# Altium schematic sheet PWR_SW.SchDoc
size A4; SheetNumber: 11; SheetTotal: 21
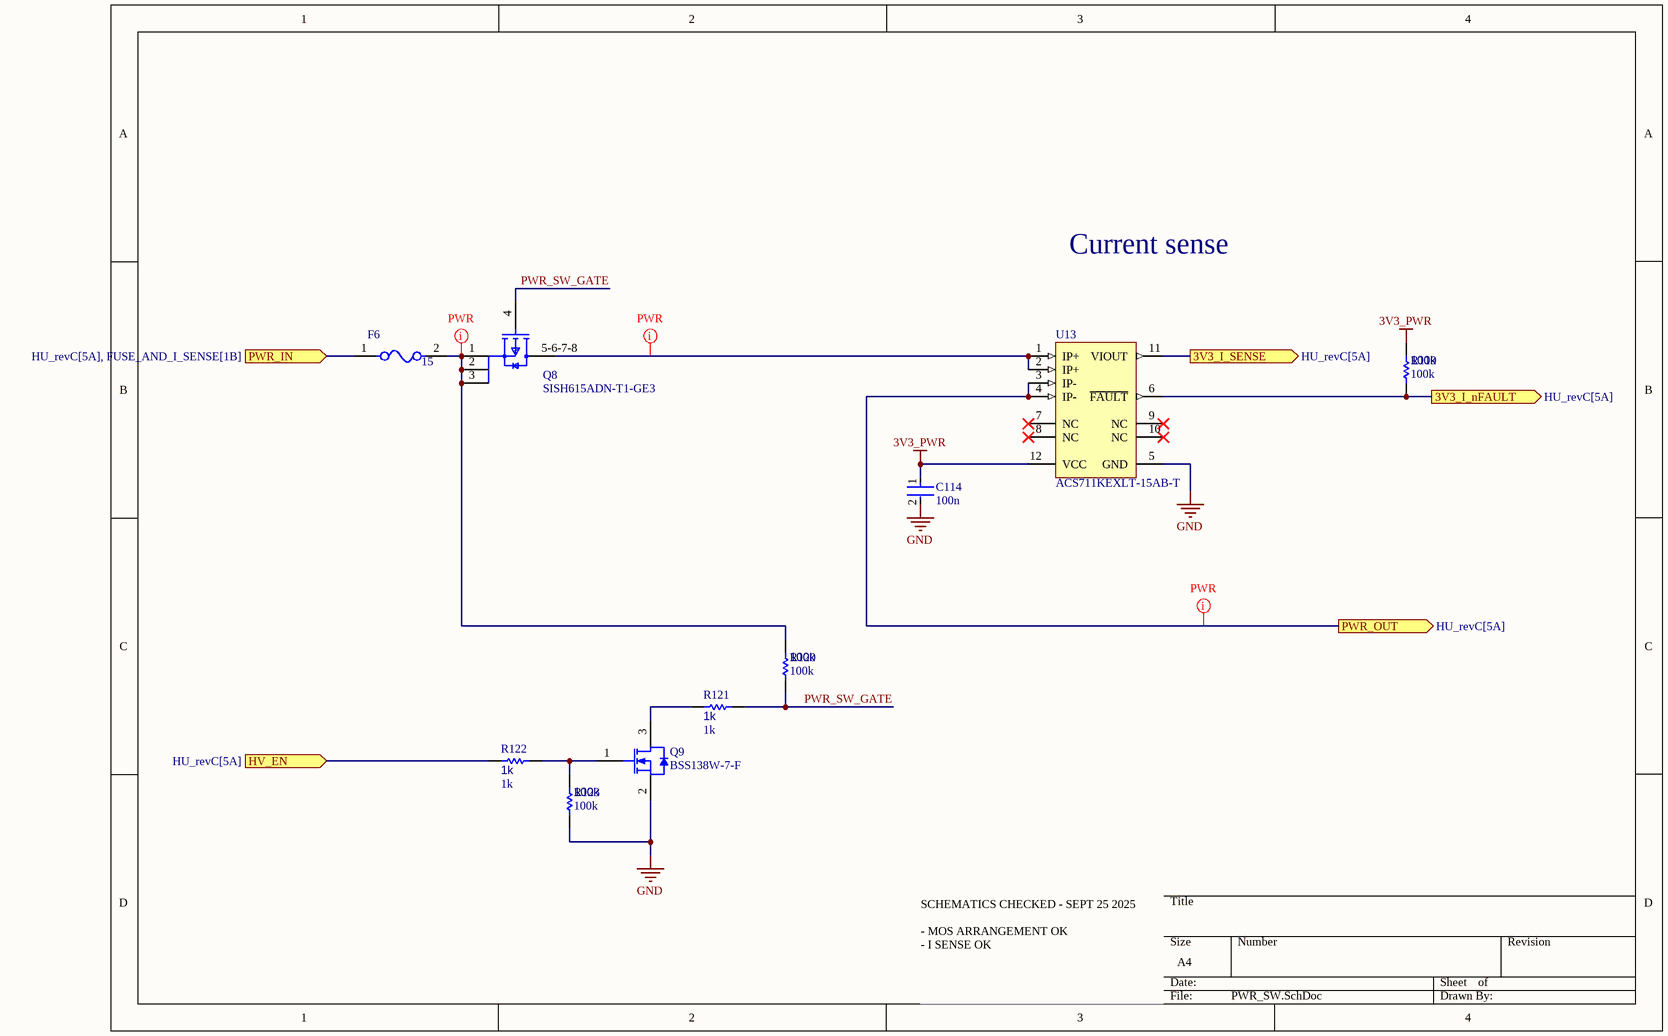
[diagram p0: PWR_SW.SchDoc]

## Parts
C114  100n  [FP-0402-L_1_0_0_05-W_0_5-IPC_A]
F6  15  [FP-0685T-MFG]
Q8  SISH615ADN-T1-GE3  [SISH615ADN-T1-GE3-Footprint-1]
Q9  BSS138W-7-F  [DIOD-SOT323-3_V]
R119  100k  [R0603B]
R120  100k  [R0603B]
R121  1k  [R0603B]
R122  1k  [R0603B]
R123  100k  [R0603B]
U13  ACS711KEXLT-15AB-T  [ALEG-EX-12_V]

## Ports
3V3_I_nFAULT (out, see HU_revC[5A]), 3V3_I_SENSE (out, see HU_revC[5A]), HV_EN (in, see HU_revC[5A]), PWR_IN (in, see HU_revC[5A], FUSE_AND_I_SENSE[1B]), PWR_OUT (out, see HU_revC[5A])

## Nets
3V3_PWR: C114.1 R119.2 U13.12(VCC)
GND: C114.2 Q9.2(S) R123.1 U13.5(GND)
3V3_I_nFAULT: R119.1 U13.6(~{FAULT}) ; port 3V3_I_nFAULT
3V3_I_SENSE: U13.11(VIOUT) ; port 3V3_I_SENSE
HV_EN: R122.1 ; port HV_EN
PWR_IN: F6.1 ; port PWR_IN
PWR_OUT: U13.3(IP-) U13.4(IP-) ; port PWR_OUT
PWR_SW_GATE: Q8.4(G) R120.1 R121.2
NetF6_2: F6.2 Q8.1(S) Q8.2(S) Q8.3(S) R120.2
NetQ8_5-6-7-8: Q8.5-6-7-8(D) U13.1(IP+) U13.2(IP+)
NetQ9_1: Q9.1(G) R122.2 R123.2
NetQ9_3: Q9.3(D) R121.1

Not connected (* = marked no-connect by the designer): U13 7(NC)* 8(NC)* 9(NC)* 10(NC)*

## Layout directives
net class PWR: NetF6_2, NetQ8_5-6-7-8, PWR_OUT

## Notes on the sheet
- Current sense
- SCHEMATICS CHECKED - SEPT 25 2025
  - MOS ARRANGEMENT OK
  - I SENSE OK

## Library data of the parts
C114 = CMP-001-00058-1: LARGE PADS, 0402 CAP, CHANGE COMMENT TO MATCH REAL P/N; Capacitor Type: Ceramic; Min Operating Temperature: -55°C; Mounting Technology: Surface Mount; Pins: 2; Case/Package: 0402; RoHS Compliant: Yes; Max Operating Temperature: 85°C
F6 = CMP-16042-000006-1: FUSE BOARD MNT 5A 63VAC/VDC 1206; RoHS Compliant: Yes
Q8 = CMP-013-00018-2: Trans MOSFET P-CH 20V 22.1A 8-Pin PowerPAK 1212 EP T/R; Source: SISH615ADN-T1-GE3.SchLib; Design Item ID: CMP-013-00036-4; Component Type: Standard; Pins: 5
Q9 = CMP-2000-05968-1: N-Channel Enhancement Mode Mosfet, 50 V, 200 mA, -55 to 150 degC, 6-Pin SOT-323, RoHS, Tape and Reel; Typical Turn-Off Delay Time: 20ns; Number of Channels: 1Channel; Type: EnhancementModeFieldEffectTransistor; Brand: DiodesIncorporated; Vds - Drain-Source Breakdown Voltage: 75V; Vgs - Gate-Source Voltage: 20V; Rds On - Drain-Source Resistance: 1.4Ohms; Transistor Type: 1N-Channel; Configuration: Single; Unit Weight: 0.000212oz; Pd - Power Dissipation: 200mW; Id - Continuous Drain Current: 200mA; Forward Transconductance - Min: 0.1S; Manufacturer URL: http://www.diodes.com/; Series: BSS138; Package Description: 3-Pin Small Outline Transistor, Body 2 x 1.25 mm, Pitch 0.65 mm; Mounting Technology: SurfaceMount; Product Category: MOSFET; RoHS: True; Maximum Operating Temperature: +150C; Height: 1mm; Length: 2.2mm; Technology: Si; Width: 1.35mm; Datasheet URL: http://www.diodes.com/_files/datasheets/ds30206.pdf; Manufacturer: DiodesIncorporated; Package / Case: SOT-323-3; Typical Turn-On Delay Time: 20ns; Transistor Polarity: N-Channel; Factory Pack Quantity: 3000; Packaging: Reel; Product: MOSFETSmallSignal; Datasheet Version: Rev. 11-2, 09/2013; Package Reference: SOT323; Minimum Operating Temperature: -55C; Mounting Style: SMD/SMT; Channel Mode: Enhancement
R119-R123 = CMP-009-00002-14: Resistor
  R119 R120 R123: Value: 100k
  R121 R122: Value: 1k
U13 = CMP-1557-00001-1: Hall Effect Linear Current Sensor with Overcurrent Fault Output for <100 V Isolation Applications, 3 to 5.5 V, -15.5 to 15.5 A IP, -40 to 125 degC, 12-Pin QFN (EX), RoHS, Tape and Reel; VCC Max: 5.5 V; IP Max: 15.5 A; VCC Min: 3 V; IP Min: -15.5 A; -3dB Bandwidth: 0.1 MHz; PackageDescription: 12-Pin Quad Flat No-Lead, Body 3 x 3 mm, Height 0.8 mm; ComponentLink1URL: http://www.allegromicro.com/; Packing: Tape and Reel; ComponentLink2URL: http://www.allegromicro.com/~/media/Files/Datasheets/ACS711-Datasheet.ashx?la=en; DatasheetVersion: Rev. 3; PartNumber: ACS711KEXLT-15AB-T; ComponentLink2Description: Datasheet; ComponentLink3URL: http://www.allegromicro.com/~/media/Files/Datasheets/ACS711-Datasheet.ashx?la=en; RoHS: TRUE; ComponentLink1Description: Manufacturer URL; ComponentLink3Description: Package Specification; Temperature Max: 125 degC; Mounting Technology: Surface Mount; Temperature Min: -40 degC